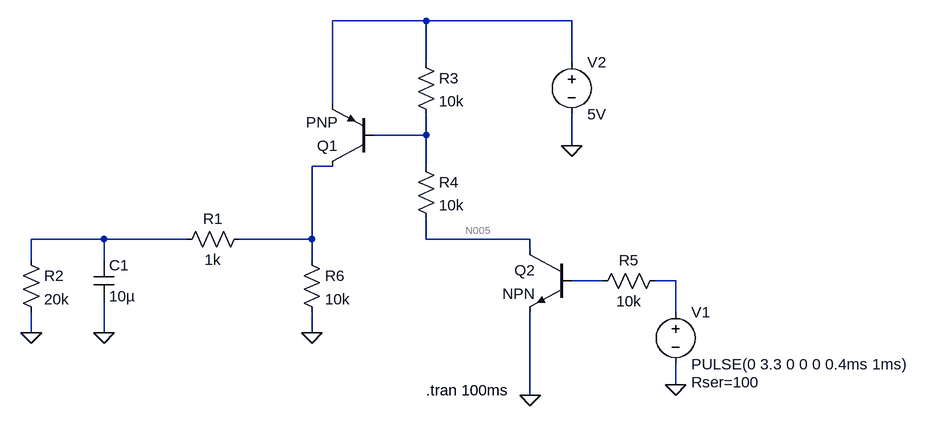
[diagram p0: schematic Draft2.asc]
Draft2.asc, the LTspice schematic file:
Version 4.1
SHEET 1 1352 680
WIRE 592 -240 448 -240
WIRE 816 -240 592 -240
WIRE 592 -176 592 -240
WIRE 816 -176 816 -240
WIRE 448 -112 448 -240
WIRE 592 -64 592 -96
WIRE 592 -64 512 -64
WIRE 816 -48 816 -96
WIRE 448 -16 416 -16
WIRE 592 -16 592 -64
WIRE 96 96 -16 96
WIRE 224 96 96 96
WIRE 416 96 416 -16
WIRE 416 96 304 96
WIRE 592 96 592 64
WIRE 752 96 592 96
WIRE 752 112 752 96
WIRE -16 128 -16 96
WIRE 96 128 96 96
WIRE 416 128 416 96
WIRE 864 160 816 160
WIRE 976 160 944 160
WIRE 976 208 976 160
WIRE -16 240 -16 208
WIRE 96 240 96 192
WIRE 416 240 416 208
WIRE 976 320 976 288
WIRE 752 336 752 208
FLAG 96 240 0
FLAG 976 320 0
FLAG -16 240 0
FLAG 816 -48 0
FLAG 752 336 0
FLAG 416 240 0
SYMBOL res 320 80 R90
WINDOW 0 0 56 VBottom 2
WINDOW 3 32 56 VTop 2
SYMATTR InstName R1
SYMATTR Value 1k
SYMBOL cap 80 128 R0
SYMATTR InstName C1
SYMATTR Value 10µ
SYMBOL voltage 976 192 R0
WINDOW 123 0 0 Left 0
WINDOW 39 24 124 Left 2
SYMATTR SpiceLine Rser=100
SYMATTR InstName V1
SYMATTR Value PULSE(0 3.3 0 0 0 0.4ms 1ms)
SYMBOL res -32 112 R0
SYMATTR InstName R2
SYMATTR Value 20k
SYMBOL voltage 816 -192 R0
WINDOW 123 0 0 Left 0
WINDOW 39 0 0 Left 0
SYMATTR InstName V2
SYMATTR Value 5V
SYMBOL pnp 512 -16 R180
SYMATTR InstName Q1
SYMBOL res 576 -192 R0
SYMATTR InstName R3
SYMATTR Value 10k
SYMBOL res 576 -32 R0
SYMATTR InstName R4
SYMATTR Value 10k
SYMBOL npn 816 112 M0
SYMATTR InstName Q2
SYMBOL res 960 144 R90
WINDOW 0 0 56 VBottom 2
WINDOW 3 32 56 VTop 2
SYMATTR InstName R5
SYMATTR Value 10k
SYMBOL res 400 112 R0
SYMATTR InstName R6
SYMATTR Value 10k
TEXT 592 328 Left 2 !.tran 100ms

The netlist it stands for:
* Draft2.asc
R1 N003 N004 1k
C1 N004 0 10µ
V1 N007 0 PULSE(0 3.3 0 0 0 0.4ms 1ms) Rser=100
R2 N004 0 20k
V2 N001 0 5V
Q1 N003 N002 N001 0 PNP
R3 N001 N002 10k
R4 N002 N005 10k
Q2 N005 N006 0 0 NPN
R5 N007 N006 10k
R6 N003 0 10k
.model NPN NPN
.model PNP PNP
.lib standard.bjt
.tran 100ms
.backanno
.end

* Results of the author's LTspice run, read from the files saved beside the schematic
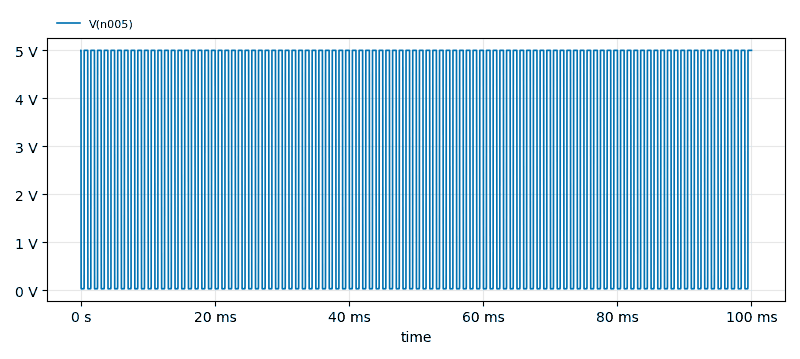
[diagram p1: Transient Analysis of Draft2.asc, plotted from the saved traces]
* Transient Analysis, 1 run:
*   V(n005): min 33.96 mV, max 5 V, average 2.687 V, rms 3.654 V, last 5 V